# EAGLE design Remote_Board_V1.0 (EAGLE 9.6.2)
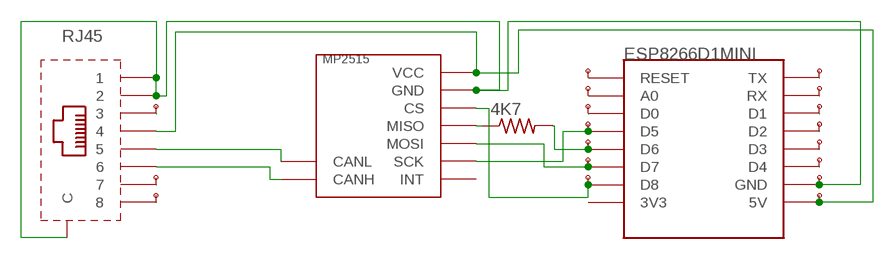
[diagram p0: schematic, sheet 1]

## Parts
4K7  R-US_0207/10  [0207/10]
ESP8266D1MINI  WEMOS-D1-MINI_SEM_LAYOUT  [WEMOS-D1-MINI_SEM_LAYOUT]
RJ45  ALI-RJ45_SEM_LAYOUT  [ALI-RJ45_SEM_LAYOUT]
U$1  TP  [TP]
U$2  TP  [TP]
U$3  TP  [TP]
U$4  TP  [TP]
U$5  TP  [TP]
U$6  TP  [TP]
U$7  TP  [TP]
U$8  TP  [TP]
U$9  TP  [TP]
U$10  TP  [TP]
U$11  TP  [TP]
U$12  TP  [TP]
U$13  TP  [TP]
U$14  TP  [TP]
U$15  TP  [TP]
U$16  TP  [TP]
U$17  TP  [TP]
U$18  TP  [TP]
U$31  MCP2515_MODULE_SEM_LAYOUT  [MCP2515_MODULE_SEM_LAYOUT]

## Nets
GND [GND]: ESP8266D1MINI.GND RJ45.1 RJ45.2 RJ45.P$1(C) RJ45.P$2(C) U$15.P$1 U$31.GND
N$1 [+3.3V]: RJ45.3 U$10.P$1
N$2: RJ45.7 U$17.P$1
N$3: RJ45.8 U$18.P$1
N$4: ESP8266D1MINI.RESET U$1.P$1
N$5: ESP8266D1MINI.A0 U$2.P$1
N$6: ESP8266D1MINI.D0 U$3.P$1
N$7: ESP8266D1MINI.D5 U$4.P$1 U$31.SCK
N$8: 4K7.2 ESP8266D1MINI.D6 U$5.P$1
N$9: ESP8266D1MINI.D7 U$8.P$1 U$31.MOSI
N$10: ESP8266D1MINI.D8 U$9.P$1 U$31.CS
N$13: ESP8266D1MINI.D4 U$14.P$1
N$14: ESP8266D1MINI.D3 U$13.P$1
N$15: ESP8266D1MINI.D2 U$12.P$1
N$16: ESP8266D1MINI.D1 U$11.P$1
N$17: ESP8266D1MINI.RX U$7.P$1
N$18: ESP8266D1MINI.TX U$6.P$1
N$21 [+5V]: ESP8266D1MINI.5V RJ45.4 U$16.P$1 U$31.VCC
N$22: RJ45.5 U$31.CL(CANL)
N$23: RJ45.6 U$31.CH(CANH)
N$24: 4K7.1 U$31.MISO
Unconnected: ESP8266D1MINI.3V3 U$31.INT

## Library data of the parts
4K7 = rcl:R-US_: RESISTOR, American symbol; SPICEPREFIX: R
ESP8266D1MINI = esp8266modules:WEMOS-D1-MINI_SEM_LAYOUT: WeMos.cc D1 mini ESP8266 module
RJ45 = AliExpressRJ45:ALI-RJ45_SEM_LAYOUT
U$1-U$18 = edurobotParts:TP
U$31 = MCP2515_Module:MCP2515_MODULE_SEM_LAYOUT

## Net classes
0 default: width 0.15 mm
1 +5V: width 0.305 mm
2 GND: width 0.305 mm
3 +3.3V: width 0.305 mm
4 SCL: width 0.15 mm
5 SDA: width 0.15 mm

## Board
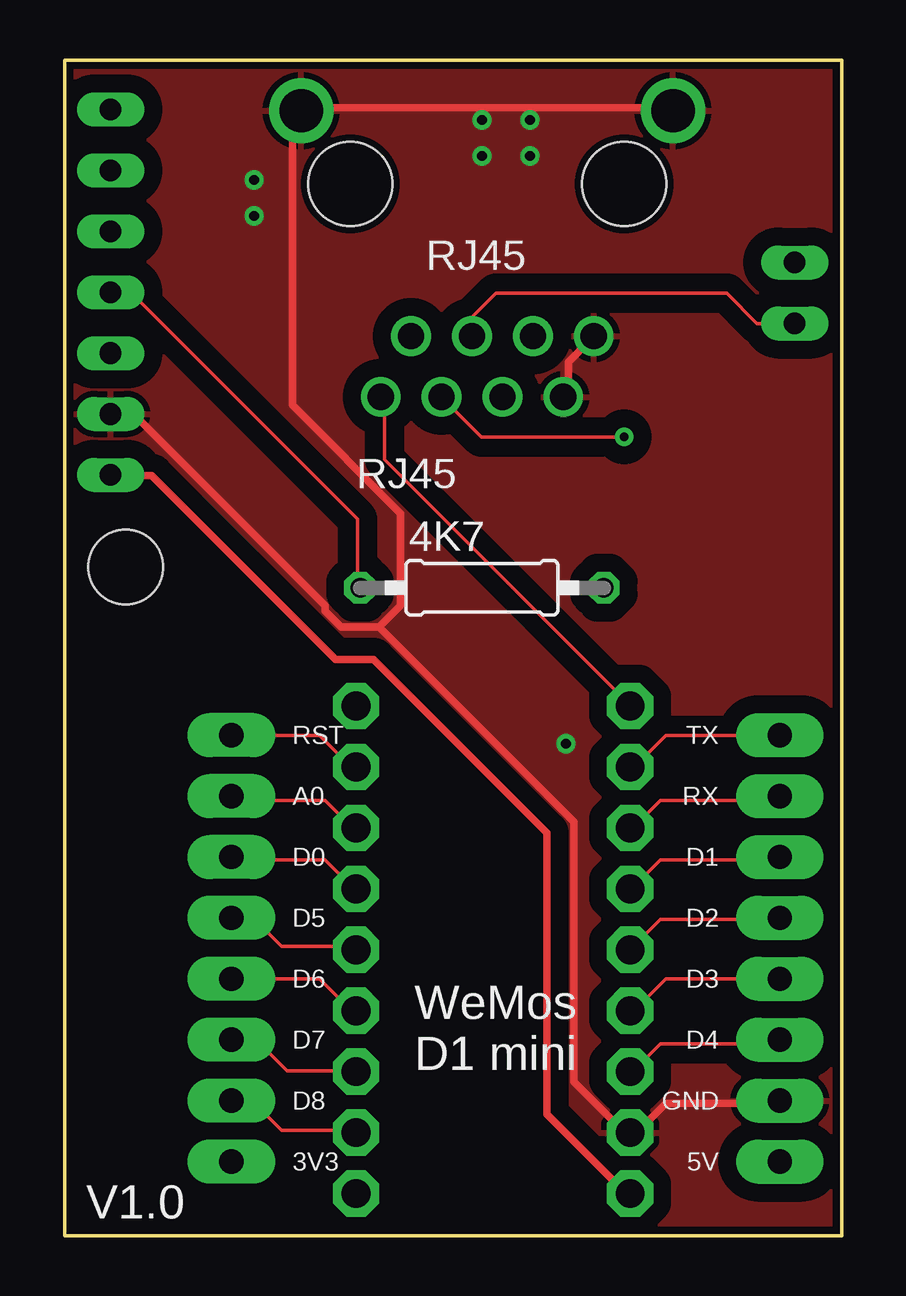
[diagram p1: board, top side]
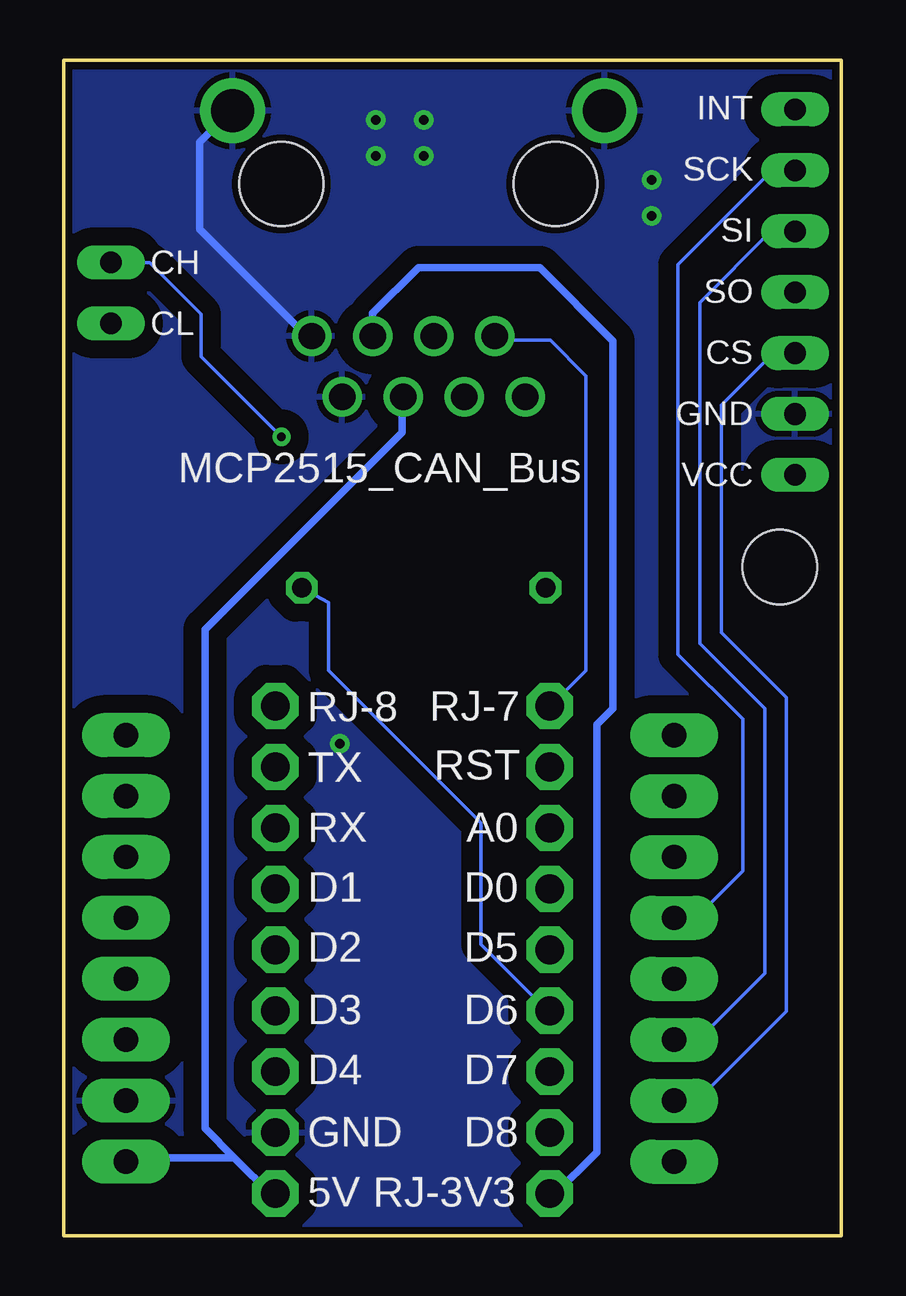
[diagram p2: board, bottom side, seen from below]

Size 32.4 x 49 mm. Coordinates in mm from the lower left corner, seen from the top.
Outline: 0,0 0,49 32.4,49 32.4,0 0,0
Copper layers (1*16): Top 0.035mm / dielectric 1.5mm / Bottom 0.035mm
Design rules "default *": minimum track width 6mil, minimum drill 0.35mm, track to track 0.75mm, track to pad 0.75mm, pad to pad 6mil, via to via 6mil, smd to smd 6mil, copper to edge 0.3mm, drill to drill 6mil, minimum pad ring 10mil, minimum via ring 8mil, stop-mask expansion 4mil, vias tented up to drill 0mil, thermal gap 10mil

### Footprints (pad centres in the part's own frame; a part is rotated, then mirrored left to right if it is on the bottom)
0207/10 = drill 0.813 octagon: 1 -5.08,0; 2 5.08,0
WEMOS-D1-MINI_SEM_LAYOUT = drill 1.016 pad 1.829 long: 3V3 -10.16,-10.16; 5V 12.7,-10.16; A0 -10.16,5.08; D0 -10.16,2.54; D1 12.7,2.54; D2 12.7,0; D3 12.7,-2.54; D4 12.7,-5.08; D5 -10.16,0; D6 -10.16,-2.54; D7 -10.16,-5.08; D8 -10.16,-7.62; GND 12.7,-7.62; RESET -10.16,7.62; RX 12.7,5.08; TX 12.7,7.62
ALI-RJ45_SEM_LAYOUT = drill 1.1: 1 -4.445,6.35; 2 -3.175,8.89; 3 -1.905,6.35; 4 -0.635,8.89; 5 0.635,6.35; 6 1.905,8.89; 7 3.175,6.35; 8 4.445,8.89 | drill 1.8: P$1 -7.75,-3.05; P$2 7.75,-3.05 | hole 3.5: -5.715,0; 5.715,0
TP = drill 1.2 pad 1.93 octagon: P$1 0,0
MCP2515_MODULE_SEM_LAYOUT = drill 0.9 pad 1.3 long: CH 28.52,-6.38; CL 28.52,-8.92; CS 0,-10.16; GND 0,-12.7; INT 0,0; MISO 0,-7.62; MOSI 0,-5.08; SCK 0,-2.54; VCC 0,-15.24 | hole 3.1: 0.63,-19.07

### Placement (x,y rotation side)
4K7  17.4,27 0 top
ESP8266D1MINI  17.12,13.24 0 top
RJ45  17.62,43.84 180 top
U$1  12.15,19.53 0 top
U$2  12.15,16.99 0 top
U$3  12.15,14.45 0 top
U$4  12.15,11.91 0 top
U$5  12.15,9.37 0 top
U$6  23.58,19.53 0 top
U$7  23.58,16.99 0 top
U$8  12.15,6.83 0 top
U$9  12.15,4.29 0 top
U$10  12.15,1.75 0 top
U$11  23.58,14.45 0 top
U$12  23.58,11.91 0 top
U$13  23.58,9.37 0 top
U$14  23.58,6.83 0 top
U$15  23.58,4.29 0 top
U$16  23.58,1.75 0 top
U$17  12.15,22.07 0 top
U$18  23.58,22.07 0 top
U$31  1.92,46.94 0 top

### Tracks (layer width: path | path; a pad name or v marks a point on that pad's centre or on a via)
GND  (via drill 0.4 pad 0.7)
  Top 0.305: RJ45.2 21.01,35.06 21.01,36.41 21.91,37.31 RJ45.1 | ESP8266D1MINI.GND 29.81,5.5 25.07,5.5 23.71,4.15 U$15.P$1 23.49,4.38 23.04,4.83 22.81,4.83 21.23,6.41 21.23,17.23 13.11,25.36 | 13.11,25.36 11.53,25.36 10.86,26.03 10.86,26.26 2.96,34.16 2.01,34.16 U$31.GND | 13.11,25.36 14.01,26.26 14.01,30.09 9.5,34.61 9.5,46.56 9.73,46.79 RJ45.P$2 9.95,47.01 25.29,47.01 RJ45.P$1
  Bottom 0.305: RJ45.1 22.28,37.49 26.75,41.95 26.75,45.56 25.52,46.79 RJ45.P$1
  other vias: 17.4,45 20.9,20.5 17.4,46.5 19.4,45 19.4,46.5 7.9,44 7.9,42.5
  pour Top: -0.6,50 -0.6,-1 33.4,-1 33.4,50
  pour Bottom: -0.6,50 -0.6,-1 33.4,-1 33.4,50
N$1
  Bottom 0.305: RJ45.3 19.52,38.44 17.62,40.34 12.56,40.34 9.5,37.28 9.5,21.97 10.18,21.3 10.18,3.47 11.98,1.67 U$10.P$1
N$2
  Bottom 0.152: RJ45.7 14.24,37.31 12.11,37.31 10.63,35.83 10.63,23.55 11.98,22.2 U$17.P$1
N$3
  Top 0.152: RJ45.8 13.34,34.83 13.34,32.35 23.49,22.2 U$18.P$1
N$4
  Top 0.152: ESP8266D1MINI.RESET 7.02,20.84 10.63,20.84 11.98,19.49 U$1.P$1
N$5
  Top 0.152: ESP8266D1MINI.A0 7.02,18.14 10.86,18.14 11.98,17.01 U$2.P$1
N$6
  Top 0.152: ESP8266D1MINI.D0 7.02,15.66 10.86,15.66 11.98,14.53 U$3.P$1
N$7
  Top 0.152: U$4.P$1 11.98,12.05 9.05,12.05 7.92,13.17 7.02,13.17 ESP8266D1MINI.D5
  Bottom 0.152: U$31.SCK 2.01,44.31 2.96,44.31 6.79,40.47 6.79,24.23 4.09,21.52 4.09,15.2 5.89,13.4 6.79,13.4 ESP8266D1MINI.D5
N$8
  Top 0.152: ESP8266D1MINI.D6 7.02,10.69 10.63,10.69 11.98,9.34 U$5.P$1
  Bottom 0.152: 4K7.2 21.36,26.39 21.36,23.55 15.01,17.2 15.01,12.14 12.21,9.34 U$5.P$1
N$9
  Top 0.152: U$8.P$1 11.98,6.86 9.28,6.86 8.15,7.99 7.02,7.99 ESP8266D1MINI.D7
  Bottom 0.152: U$31.MOSI 2.01,41.83 2.96,41.83 5.89,38.89 5.89,24.68 3.19,21.97 3.19,10.92 5.89,8.21 6.79,8.21 ESP8266D1MINI.D7
N$10
  Top 0.152: U$9.P$1 11.98,4.38 9.05,4.38 7.92,5.5 7.02,5.5 ESP8266D1MINI.D8
  Bottom 0.152: U$31.CS 2.01,36.64 2.96,36.64 4.99,34.61 4.99,25.13 2.28,22.42 2.28,9.34 5.89,5.73 6.79,5.73 ESP8266D1MINI.D8
N$13
  Top 0.152: ESP8266D1MINI.D4 29.81,7.99 24.84,7.99 23.71,6.86 U$14.P$1
N$14
  Top 0.152: ESP8266D1MINI.D3 29.81,10.69 25.07,10.69 23.71,9.34 U$13.P$1
N$15
  Top 0.152: ESP8266D1MINI.D2 29.81,13.17 24.84,13.17 23.71,12.05 U$12.P$1
N$16
  Top 0.152: ESP8266D1MINI.D1 29.81,15.66 24.84,15.66 23.71,14.53 U$11.P$1
N$17
  Top 0.152: ESP8266D1MINI.RX 29.81,18.14 24.84,18.14 23.71,17.01 U$7.P$1
N$18
  Top 0.152: ESP8266D1MINI.TX 29.81,20.84 25.07,20.84 23.71,19.49 U$6.P$1
N$21
  Top 0.305: U$31.VCC 2.01,31.67 3.64,31.67 11.31,24 12.89,24 20.11,16.78 20.11,5.05 23.49,1.67 U$16.P$1
  Bottom 0.305: 25.29,3.25 23.71,1.67 U$16.P$1 | 25.29,3.25 26.52,4.47 26.52,25.26 18.3,33.48 18.3,34.83 RJ45.4 | 25.29,3.25 29.81,3.25 ESP8266D1MINI.5V
N$22
  Top 0.152: U$31.CL 28.87,38.02 27.6,39.29 17.99,39.29 16.98,38.28 RJ45.5
N$23  (via drill 0.35)
  Top 0.152: RJ45.6 17.38,33.29 v23.33,33.29
  Bottom 0.152: U$31.CH 28.82,40.56 26.67,38.41 26.67,36.63 v23.33,33.29
N$24
  Top 0.152: 4K7.1 12.21,27.16 12.21,29.87 2.96,39.12 2.01,39.12 U$31.MISO

### Text on the board
tPlace: V1.0
bPlace: RJ-7 | RJ-8 | RST | TX | A0 | RX | D0 | D1 | D5 | D2 | D6 | D3 | D7 | D4 | D8 | GND | RJ-3V3 | 5V